# EAGLE design controller_board (EAGLE 7.2.0)
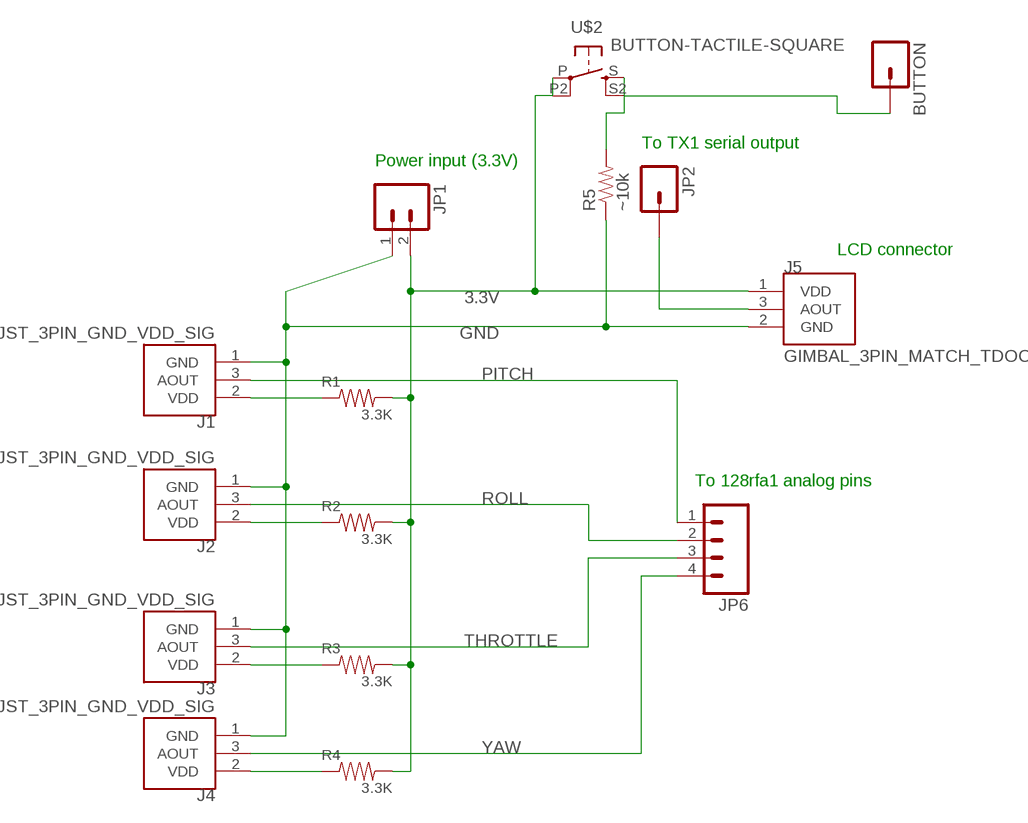
[diagram p0: schematic, sheet 1]

## Parts
BUTTON  M01PTH  [1X01]
J1  JST_3PIN_GND_VDD_SIG  [JST-3-PTH-REVERSE]
J2  JST_3PIN_GND_VDD_SIG  [JST-3-PTH-REVERSE]
J3  JST_3PIN_GND_VDD_SIG  [JST-3-PTH-REVERSE]
J4  JST_3PIN_GND_VDD_SIG  [JST-3-PTH-REVERSE]
J5  GIMBAL_3PIN_MATCH_TDOCU  [JST-3-PTH]
JP1  M021X02_NO_SILK  [1X02_NO_SILK]
JP2  M01PTH  [1X01]
JP6  M04PTH  [1X04]
R1  3.3K  RESISTOR-CFR12  [CFR-12]
R2  3.3K  RESISTOR-CFR12  [CFR-12]
R3  3.3K  RESISTOR-CFR12  [CFR-12]
R4  3.3K  RESISTOR-CFR12  [CFR-12]
R5  ~10k  RESISTORPTH-1/4W  [AXIAL-0.4]
U$2  BUTTON-TACTILE-SQUARE  [BUTTON-TACTILE-SQUARE-ADAFRUIT1010]

## Nets
3.3V: J5.1(VDD) JP1.2 R1.P$2 R2.P$2 R3.P$2 R4.P$2 U$2.P U$2.P2(P1)
GND: J1.1(GND) J2.1(GND) J3.1(GND) J4.1(GND) J5.2(GND) JP1.1 R5.P$1
N$1: J1.2(VDD) R1.P$1
N$2: J2.2(VDD) R2.P$1
N$3: J3.2(VDD) R3.P$1
N$4: J4.2(VDD) R4.P$1
N$6: BUTTON.1 R5.P$2 U$2.S U$2.S2(S1)
N$9: J5.3(AOUT) JP2.1
PITCH: J1.3(AOUT) JP6.1
ROLL: J2.3(AOUT) JP6.2
THROTTLE: J3.3(AOUT) JP6.3
YAW: J4.3(AOUT) JP6.4

## Notes on the sheet
- To TX1 serial output
- Power input (3.3V)
- LCD connector
- To 128rfa1 analog pins

## Library data of the parts
BUTTON JP2 = SparkFun-Connectors:M01: Header 1 Standard 1-pin 0.1" header. Use with straight break away headers (SKU : PRT-00116), right angle break away headers (PRT-00553), swiss pins (PRT-00743), machine pins (PRT-00117), and female headers (PRT-00115).
J1-J4 = Controller:JST_3PIN_GND_VDD_SIG
J5 = Controller:GIMBAL_3PIN_MATCH_TDOCU
JP1 = SparkFun-Connectors:M02: Standard 2-pin 0.1" header. Use with - straight break away headers ( PRT-00116) - right angle break away headers (PRT-00553) - swiss pins (PRT-00743) - machine pins (PRT-00117) - female headers (PRT-00115) Molex polarized connector foot print use with: PRT-08233 with associated crimp pins and housings. 2.54_SCREWTERM for use with PRT-10571. 3.5mm Screw Terminal footprints for PRT-08084 5mm Screw Terminal footprints for use with PRT-08432
JP6 = SparkFun-Connectors:M04: Header 4 Standard 4-pin 0.1" header. Use with straight break away headers (SKU : PRT-00116), right angle break away headers (PRT-00553), swiss pins (PRT-00743), machine pins (PRT-00117), and female headers (PRT-00115). Molex polarized connector foot print use with SKU : PRT-08231 with associated crimp pins and housings. 1MM SMD Version SKU: PRT-10208
R1-R4 = Trevor-lab4:RESISTOR; CREATOR: Trevor Smith; DIST: Digikey; DISTPN: *EBK-ND; TOL: 5%
R5 = SparkFun-Resistors:RESISTOR: Resistor Basic schematic elements and footprints for 0603, 1206, and PTH resistors.
U$2 = Controller:BUTTON-TACTILE

## Board
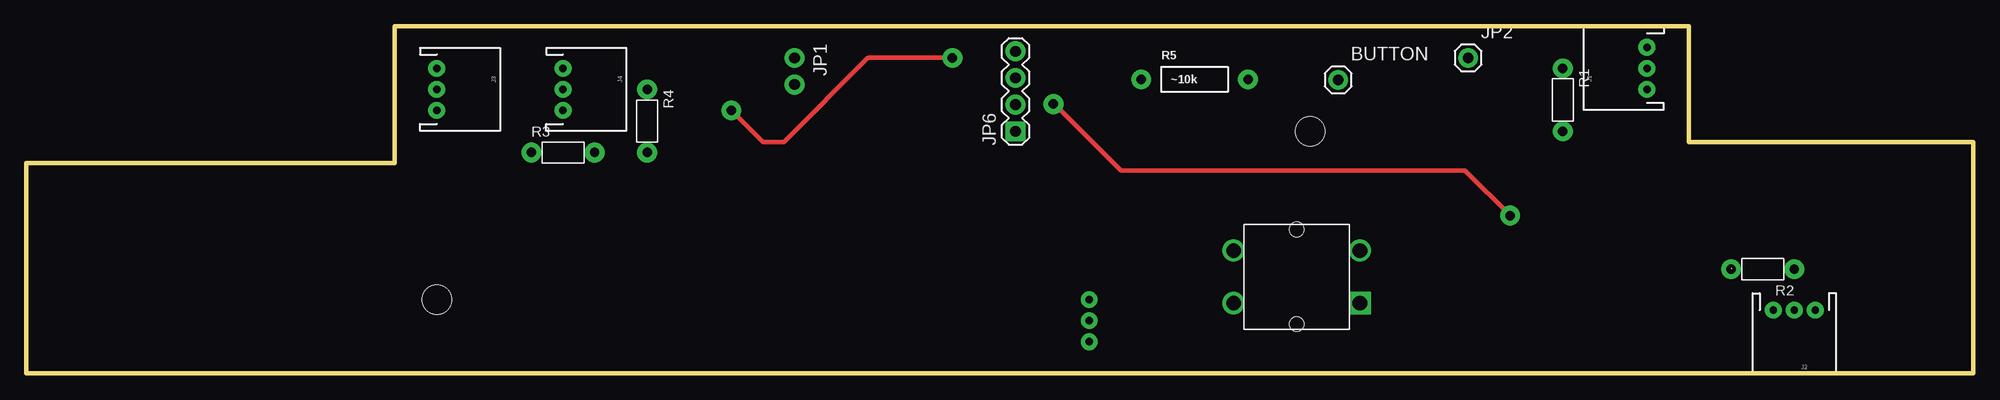
[diagram p1: board, top side]
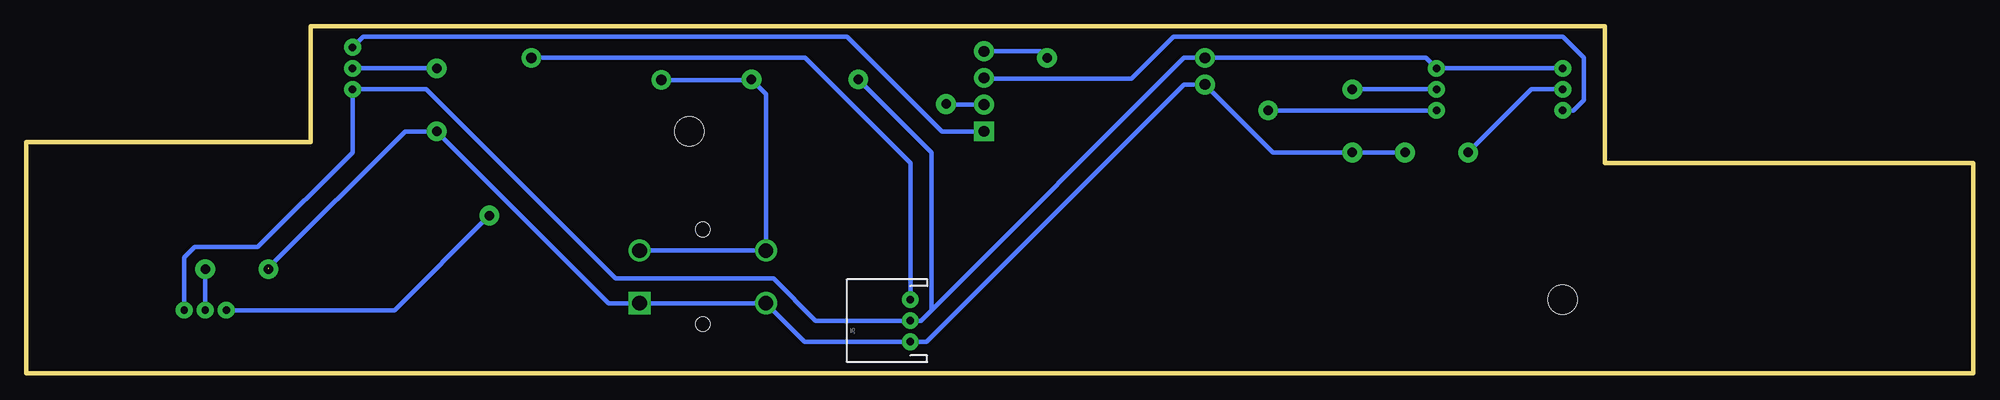
[diagram p2: board, bottom side, seen from below]

Size 185 x 33 mm. Coordinates in mm from the lower left corner, seen from the top.
Outline: 158,22 158,33 35,33 35,20 0,20 0,0 185,0 185,22 158,22
Copper layers (1*16): Top 0.035559375mm / dielectric 1.501140625mm / Bottom 0.035559375mm
Design rules "4pcb-33board *": minimum track width 8mil, minimum drill 15mil, track to track 12mil, track to pad 12mil, pad to pad 12mil, via to via 12mil, smd to smd 12mil, copper to edge 10mil, drill to drill 10mil, minimum pad ring 10mil, minimum via ring 8mil, stop-mask expansion 4mil, vias tented up to drill 0mil, thermal gap 10mil

### Footprints (pad centres in the part's own frame; a part is rotated, then mirrored left to right if it is on the bottom)
1X01 = drill 1.016 pad 1.88: 1 0,0
JST-3-PTH-REVERSE = drill 0.7 pad 1.6: 1 -2,0; 2 0,0; 3 2,0
JST-3-PTH = drill 0.7 pad 1.6: 1 -2,0; 2 0,0; 3 2,0
1X02_NO_SILK = drill 1.016 pad 1.88: 1 0,0; 2 2.54,0
1X04 = drill 1.016 pad 1.88 square: 1 0,0 | drill 1.016 pad 1.88: 2 2.54,0; 3 5.08,0; 4 7.62,0
CFR-12 = drill 0.9 pad 1.88: P$1 -3,0; P$2 3,0
AXIAL-0.4 = drill 0.9 pad 1.88: P$1 -5.08,0; P$2 5.08,0
CONNECTOR_BOARD_OUTLINE = hole 2.8: 154,45; 71,29
BUTTON-TACTILE-SQUARE-ADAFRUIT1010 = drill 1.4 square: P -6,2.5 | drill 1.4: P2 6,2.5; S -6,-2.5; S2 6,-2.5 | hole 1.4: 0,-4.5; 0,4.5

### Placement (x,y rotation side)
BUTTON  124.66,27.9 0 top
J1  154,29 90 top
J2  168,6 180 top
J3  39,27 270 top
J4  51,27 270 top
J5  101,5 90 bottom
JP1  73,30 270 top
JP2  137,30 0 top
JP6  94,23 90 top
R1  146,26 270 top
R2  165,9.9 180 top
R3  51,21 0 top
R4  59,24 270 top
R5  111.01,27.94 0 top
U$1  [CONNECTOR_BOARD_OUTLINE]  -32,-22 0 top
U$2  120.72,9.17 180 top

### Tracks (layer width: path | path; a pad name or v marks a point on that pad's centre or on a via)
3.3V  (1 unrouted)
  Bottom 0.406: R3.P$2 R4.P$2 66.54,21 JP1.2 75,27.46 99.46,3 J5.1 111.05,3 U$2.P2 U$2.P 129.67,6.67 R1.P$2 149,23 162,10
GND
  Bottom 0.406: J3.1 J4.1 52,30 JP1.1 75,30 99,6 | 99,6 100,5 J5.2 110,5 114,9 129,9 147,27 J1.1 154,21 163,12 169,12 170,11 J2.1 | 99,6 99,21.01 R5.P$1
N$1
  Bottom 0.406: R1.P$1 J1.2
N$2
  Bottom 0.406: J2.2 R2.P$1
N$3
  Bottom 0.406: J3.2 42,27 R3.P$1
N$4
  Bottom 0.406: J4.2 R4.P$1
N$6
  Bottom 0.406: U$2.S U$2.S2 114.72,26.57 R5.P$2 116.14,27.9 BUTTON.1
N$9
  Bottom 0.406: J5.3 101,20 111,30 JP2.1
PITCH
  Bottom 0.406: JP6.1 98,23 107,32 153,32 J1.3
ROLL  (via drill 0.9 pad 1.88)
  Top 0.406: v97.6,25.6 97.7,25.6 104,19.3 136.7,19.3 v141,15
  Bottom 0.406: JP6.2 97.54,25.54 v97.6,25.6 | J2.3 150,6 v141,15
THROTTLE
  Bottom 0.406: JP6.3 94,28 80,28 76,32 39,32 37,30 37,26 38,25 J3.3
YAW  (via drill 0.9 pad 1.88)
  Top 0.406: v67,25 69.99,22 71.99,22 80,30.01 v88,30
  Bottom 0.406: J4.3 v67,25 | JP6.4 88.62,30.62 v88,30

### Text on the board
tRubout: Controller Board r1 | Trevor Smith | CSE 190 Spring 2015